# Altium project DoAn2.PrjPcb
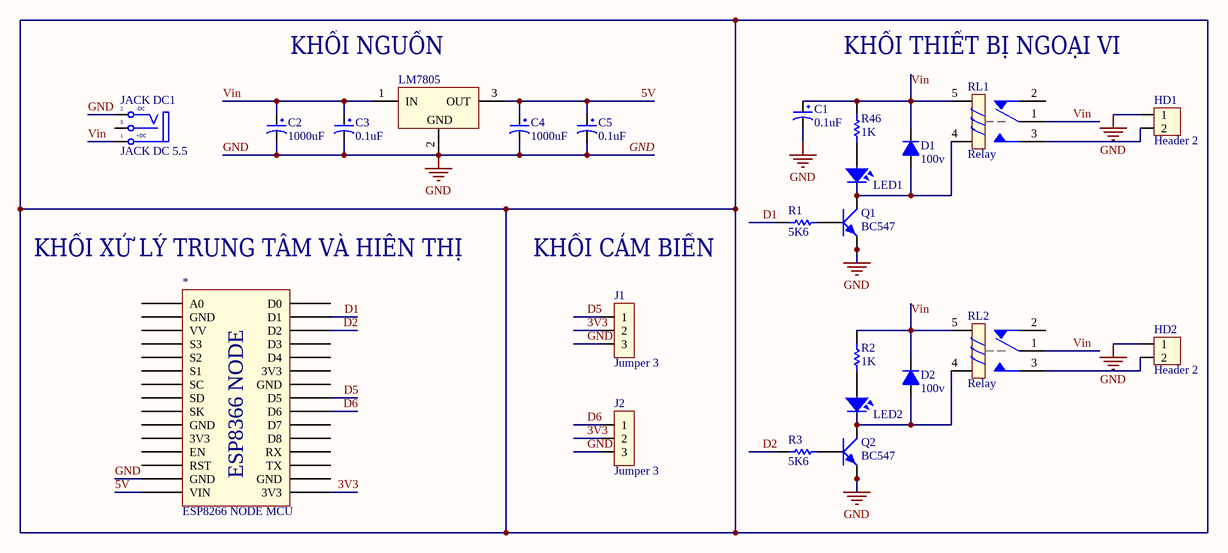
[diagram p0: Sheet1.SchDoc]
1 sheet, 24 parts. Net scope: global (net labels, ports and power ports of the same name join across sheets).
Board file: PCB2.PcbDoc

## Sheet Sheet1.SchDoc
size A4; SheetNumber: 1; SheetTotal: 1

### Parts
*  ESP8266 NODE MCU  [ESP8266 NODE MCU]
C1  0.1uF  [tu hoa 5mm]
C2  1000uF  [tu hoa 8mm]
C3  0.1uF  [tu hoa 5mm]
C4  1000uF  [tu hoa 8mm]
C5  0.1uF  [tu hoa 5mm]
D1  100v  [DIODE 1A]
D2  100v  [DIODE 1A]
HD1  Header 2  [HED2]
HD2  Header 2  [HED2]
IC1  LM7805  [QTO-220H1]
J1  Jumper 3  [JP3]
J2  Jumper 3  [JP3]
JACK_DC1  JACK DC 5.5  [JACK DC 5.5]
LED1  LED  [LED-3]  (value not drawn)
LED2  LED  [LED-3]  (value not drawn)
Q1  BC547  [TO92]
Q2  BC547  [TO92]
R1  value 5K6  [R1/4W]  (hidden comment: Res1)
R2  value 1K  [R1/4W]  (hidden comment: Res1)
R3  value 5K6  [R1/4W]  (hidden comment: Res1)
R46  value 1K  [R1/4W]  (hidden comment: Res1)
RL1  Relay  [Relay 5 Chan SRD]
RL2  Relay  [Relay 5 Chan SRD]

### Nets
GND: *.14(GND) C1.2 C2.2 C3.2 C4.2 C5.2 HD1.1 HD2.1 IC1.2(GND) J1.3 J2.3 JACK_DC1.2(TN) Q1.3(E) Q2.3(E)
3V3: *.16(3V3) J1.2 J2.2
5V: *.15(VIN) C4.1 C5.1 IC1.3(OUT)
D1: *.29(D1) R1.2
D2: *.28(D2) R3.2
D5: *.23(D5) J1.1
D6: *.22(D6) J2.1
Vin: C1.1 C2.1 C3.1 D1.2(K) D2.2(K) IC1.1(IN) JACK_DC1.1(T) R2.2 R46.2 RL1.1 RL1.5 RL2.1 RL2.5
NetD1_1: D1.1(A) LED1.2 Q1.1(C) RL1.4
NetD2_1: D2.1(A) LED2.2 Q2.1(C) RL2.4
NetHD1_2: HD1.2 RL1.3
NetHD2_2: HD2.2 RL2.3
NetLED1_1: LED1.1 R46.1
NetLED2_1: LED2.1 R2.1
NetQ1_2: Q1.2(B) R1.1
NetQ2_2: Q2.2(B) R3.1

Not connected (* = marked no-connect by the designer): * 1(A0) 2(GND) 3(VV) 4(S3) 5(S2) 6(S1) 7(SC) 8(SD) 9(SK) 10(GND) 11(3V3) 12(EN) 13(RST) 17(GND) 18(TX) 19(RX) 20(D8) 21(D7) 24(GND) 25(3V3) 26(D4) 27(D3) 30(D0); JACK_DC1 3(S); RL1 2; RL2 2

### Notes on the sheet
- KHỐI NGUỒN
- KHỐI THIẾT BỊ NGOẠI VI
- (near *) KHỐI XỬ LÝ TRUNG TÂM VÀ HIỄN THỊ
- KHỐI CẢM BIẾN
- (in symbol ESP8266 NODE MCU) ESP8366 NODE
- (in symbol JACK DC 5.5) -DC; +DC

### Library data of the parts
C1 C3 C5 = Tu Hoa 0.1uF 50V 5x11: Cắm; Don_Vi: Con; So_Chan: 2; Ten_Linh_Kien: Tụ Hóa 0.1uF 50V; Ma_Hang: MH006853; Chung_Loai: Cắm; Kieu_Chan: *
C2 C4 = Tu Hoa 1000uF 16V 8x20: Cắm; Don_Vi: Con; So_Chan: 2; Ten_Linh_Kien: Tụ Hóa 1000uF 16V 8x20MM; Ma_Hang: MH008300; Chung_Loai: Cắm; Kieu_Chan: *
D1 D2 = Diode 1N4007: Cắm; Ten_Linh_Kien: Diode 1N4007 1A (DIP); Don_Vi: Con; Ma_Hang: MH001063; Ghi Chu: *; Kieu_Chan: *; Chung_Loai: Cắm
HD1 HD2 = Hed2: Header 2 (Green); Value: Header 2
IC1 = LD78M05
J1 J2 = JP3: Value: J3
JACK_DC1 = JACK DC 5.5: Value: Jac DC
LED1 LED2 = LED: LED Single colour Green and Red; Value: LED 3 ly Single Colour
R1-R3 R46 = Res1_1: Resistor; Manufacturer: Generic Components; Class: Passive; Published: 08/06/2000; Publisher: Altium Hobart Technology Centre; SubClass: Resistor
RL1 RL2 = Relay 5 Chan SRD: Relay 5 Chan; Ma_Hang: MH009374; Ten: Relay 5V10A SRD-05VDC-SL-C Chính Hãng